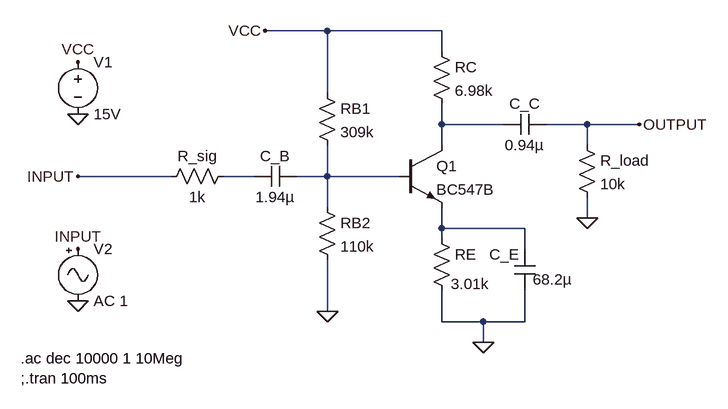
[diagram p0: schematic Draft2.asc]
Draft2.asc, the LTspice schematic file:
Version 4
SHEET 1 880 680
WIRE -80 -112 -176 -112
WIRE 96 -112 -80 -112
WIRE 96 -80 96 -112
WIRE -80 -16 -80 -112
WIRE 96 32 96 0
WIRE 192 32 96 32
WIRE 320 32 256 32
WIRE 400 32 320 32
WIRE 96 64 96 32
WIRE 320 64 320 32
WIRE -320 112 -464 112
WIRE -192 112 -240 112
WIRE -80 112 -80 64
WIRE -80 112 -128 112
WIRE 32 112 -80 112
WIRE -80 160 -80 112
WIRE 320 176 320 144
WIRE 96 192 96 160
WIRE 224 192 96 192
WIRE 96 208 96 192
WIRE 224 224 224 192
WIRE -80 320 -80 240
WIRE 96 336 96 288
WIRE 160 336 96 336
WIRE 224 336 224 288
WIRE 224 336 160 336
WIRE 160 368 160 336
FLAG 320 176 0
FLAG -80 320 0
FLAG 160 368 0
FLAG -464 112 INPUT
FLAG -464 224 INPUT
FLAG -176 -112 VCC
FLAG -464 -64 VCC
FLAG 400 32 OUTPUT
FLAG -464 304 0
FLAG -464 16 0
SYMBOL npn 32 64 R0
SYMATTR InstName Q1
SYMATTR Value BC547B
SYMBOL res -96 144 R0
SYMATTR InstName RB2
SYMATTR Value 110k
SYMBOL res -96 -32 R0
SYMATTR InstName RB1
SYMATTR Value 309k
SYMBOL res 80 -96 R0
SYMATTR InstName RC
SYMATTR Value 6.98k
SYMBOL res 80 192 R0
WINDOW 3 30 86 Left 2
SYMATTR InstName RE
SYMATTR Value 3.01k
SYMBOL res 304 48 R0
SYMATTR InstName R_load
SYMATTR Value 10k
SYMBOL res -224 96 R90
WINDOW 0 0 56 VBottom 2
WINDOW 3 32 56 VTop 2
SYMATTR InstName R_sig
SYMATTR Value 1k
SYMBOL cap -128 96 R90
WINDOW 0 0 32 VBottom 2
WINDOW 3 32 32 VTop 2
SYMATTR InstName C_B
SYMATTR Value 1.94µ
SYMBOL cap 256 16 R90
WINDOW 0 0 32 VBottom 2
WINDOW 3 32 32 VTop 2
SYMATTR InstName C_C
SYMATTR Value 0.94µ
SYMBOL cap 240 288 R180
WINDOW 0 24 56 Left 2
WINDOW 3 -57 17 Left 2
SYMATTR InstName C_E
SYMATTR Value 68.2µ
SYMBOL voltage -464 -80 R0
SYMATTR InstName V1
SYMATTR Value 15V
SYMBOL Misc\\signal -464 208 R0
SYMATTR InstName V2
SYMATTR Value AC 1
TEXT -552 392 Left 2 !.ac dec 10000 1 10Meg\n;.tran 100ms

The netlist it stands for:
* Draft2.asc
Q1 N001 N003 N004 0 BC547B
RB2 N003 0 110k
RB1 VCC N003 309k
RC VCC N001 6.98k
RE N004 0 3.01k
R_load OUTPUT 0 10k
R_sig N002 INPUT 1k
C_B N003 N002 1.94µ
C_C OUTPUT N001 0.94µ
C_E 0 N004 68.2µ
V1 VCC 0 15V
V2 INPUT 0 AC 1
.model NPN NPN
.model PNP PNP
.lib standard.bjt
.ac dec 10000 1 10Meg
;.tran 100ms
.backanno
.end